# EAGLE schematic Counter (EAGLE 6.2)
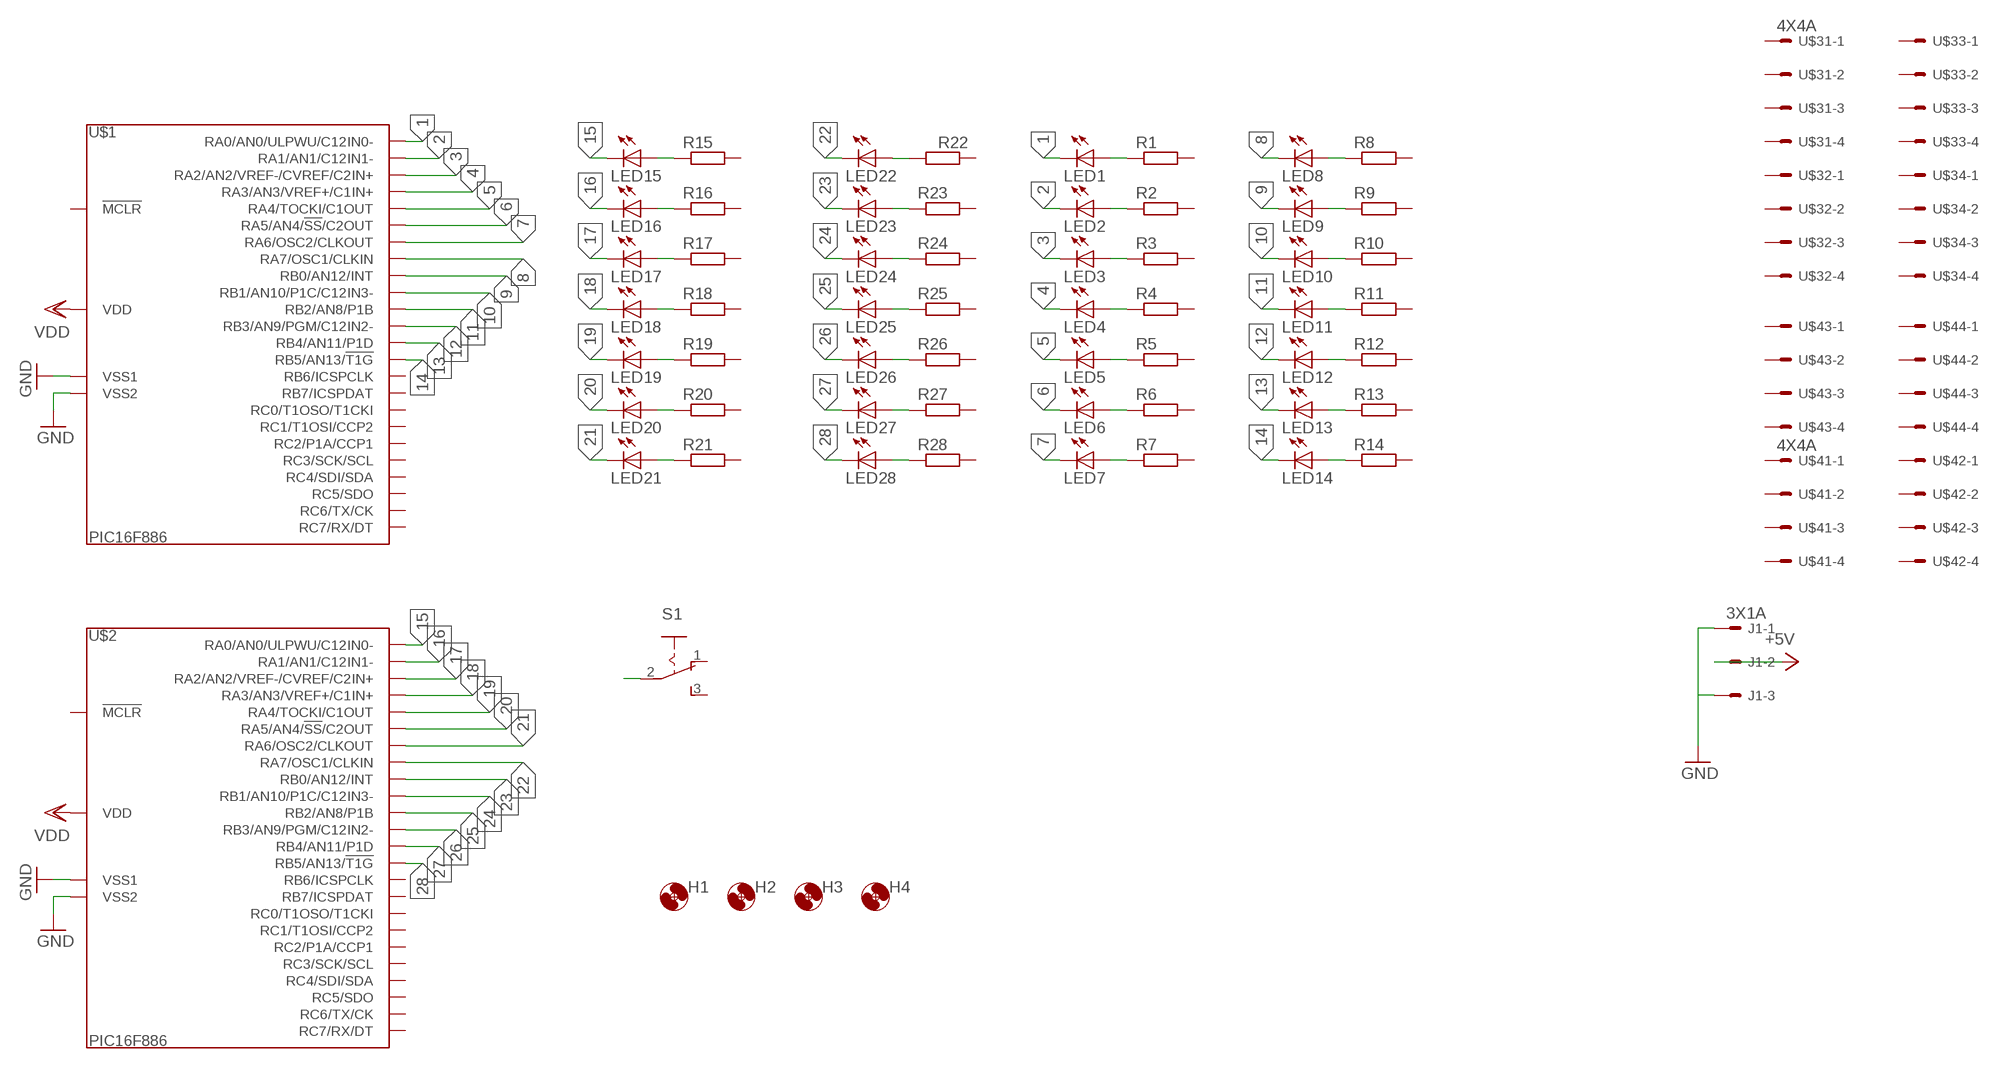
[diagram p0: schematic, sheet 1]

## Parts
H1  HOLE3.3M3BOLT  [HOLE3.3]
H2  HOLE3.3M3BOLT  [HOLE3.3]
H3  HOLE3.3M3BOLT  [HOLE3.3]
H4  HOLE3.3M3BOLT  [HOLE3.3]
J1  3X1A  [37203-62A3-003]
LED1  LED5MM  [LED5MM]
LED2  LED5MM  [LED5MM]
LED3  LED5MM  [LED5MM]
LED4  LED5MM  [LED5MM]
LED5  LED5MM  [LED5MM]
LED6  LED5MM  [LED5MM]
LED7  LED5MM  [LED5MM]
LED8  LED5MM  [LED5MM]
LED9  LED5MM  [LED5MM]
LED10  LED5MM  [LED5MM]
LED11  LED5MM  [LED5MM]
LED12  LED5MM  [LED5MM]
LED13  LED5MM  [LED5MM]
LED14  LED5MM  [LED5MM]
LED15  LED5MM  [LED5MM]
LED16  LED5MM  [LED5MM]
LED17  LED5MM  [LED5MM]
LED18  LED5MM  [LED5MM]
LED19  LED5MM  [LED5MM]
LED20  LED5MM  [LED5MM]
LED21  LED5MM  [LED5MM]
LED22  LED5MM  [LED5MM]
LED23  LED5MM  [LED5MM]
LED24  LED5MM  [LED5MM]
LED25  LED5MM  [LED5MM]
LED26  LED5MM  [LED5MM]
LED27  LED5MM  [LED5MM]
LED28  LED5MM  [LED5MM]
R1  R-EU_R3216W  [R3216W]
R2  R-EU_R3216W  [R3216W]
R3  R-EU_R3216W  [R3216W]
R4  R-EU_R3216W  [R3216W]
R5  R-EU_R3216W  [R3216W]
R6  R-EU_R3216W  [R3216W]
R7  R-EU_R3216W  [R3216W]
R8  R-EU_R3216W  [R3216W]
R9  R-EU_R3216W  [R3216W]
R10  R-EU_R3216W  [R3216W]
R11  R-EU_R3216W  [R3216W]
R12  R-EU_R3216W  [R3216W]
R13  R-EU_R3216W  [R3216W]
R14  R-EU_R3216W  [R3216W]
R15  R-EU_R3216W  [R3216W]
R16  R-EU_R3216W  [R3216W]
R17  R-EU_R3216W  [R3216W]
R18  R-EU_R3216W  [R3216W]
R19  R-EU_R3216W  [R3216W]
R20  R-EU_R3216W  [R3216W]
R21  R-EU_R3216W  [R3216W]
R22  R-EU_R3216W  [R3216W]
R23  R-EU_R3216W  [R3216W]
R24  R-EU_R3216W  [R3216W]
R25  R-EU_R3216W  [R3216W]
R26  R-EU_R3216W  [R3216W]
R27  R-EU_R3216W  [R3216W]
R28  R-EU_R3216W  [R3216W]
S1  SLIDESW  [SLIDESW]
U$1  PIC16F886  [DIL28]
U$2  PIC16F886  [DIL28]
U$3  4X4A  [37216-62A3-004]
U$4  4X4A  [37216-62A3-004]

## Nets
1: LED1.K(C) U$1.2(RA0/AN0/ULPWU/C12IN0-)
2: LED2.K(C) U$1.3(RA1/AN1/C12IN1-)
3: LED3.K(C) U$1.4(RA2/AN2/VREF-/CVREF/C2IN+)
4: LED4.K(C) U$1.5(RA3/AN3/VREF+/C1IN+)
5: LED5.K(C) U$1.6(RA4/TOCKI/C1OUT)
6: LED6.K(C) U$1.7(RA5/AN4/!SS!/C2OUT)
7: LED7.K(C) U$1.10(RA6/OSC2/CLKOUT)
8: LED8.K(C) U$1.9(RA7/OSC1/CLKIN)
9: LED9.K(C) U$1.21(RB0/AN12/INT)
10: LED10.K(C) U$1.22(RB1/AN10/P1C/C12IN3-)
11: LED11.K(C) U$1.23(RB2/AN8/P1B)
12: LED12.K(C) U$1.24(RB3/AN9/PGM/C12IN2-)
13: LED13.K(C) U$1.25(RB4/AN11/P1D)
14: LED14.K(C) U$1.26(RB5/AN13/!T1G)
15: LED15.K(C)
16: LED16.K(C)
17: LED17.K(C)
18: LED18.K(C)
19: LED19.K(C)
20: LED20.K(C)
21: LED21.K(C)
22: LED22.K(C)
23: LED23.K(C)
24: LED24.K(C)
25: LED25.K(C)
26: LED26.K(C)
27: LED27.K(C)
28: LED28.K(C)
+5V: J1.1-2
GND: J1.1-1 J1.1-3 U$1.8(VSS1) U$1.19(VSS2) U$2.8(VSS1) U$2.19(VSS2)
N$1: LED1.A R1.1
N$2: LED2.A R2.1
N$3: LED3.A R3.1
N$4: LED4.A R4.1
N$5: LED5.A R5.1
N$6: LED6.A R6.1
N$7: LED7.A R7.1
N$8: LED8.A R8.1
N$9: LED9.A R9.1
N$10: LED10.A R10.1
N$11: LED11.A R11.1
N$12: LED12.A R12.1
N$13: LED13.A R13.1
N$14: LED14.A R14.1
N$15: LED15.A R15.1
N$16: LED16.A R16.1
N$17: LED17.A R17.1
N$18: LED18.A R18.1
N$19: LED19.A R19.1
N$20: LED20.A R20.1
N$21: LED21.A R21.1
N$22: LED22.A R22.2
N$23: LED23.A R23.1
N$24: LED24.A R24.1
N$25: LED25.A R25.1
N$26: LED26.A R26.1
N$27: LED27.A R27.1
N$28: LED28.A R28.1
N$29: S1.2
VDD: U$1.20(VDD) U$2.20(VDD)
Unconnected: R1.2 R2.2 R3.2 R4.2 R5.2 R6.2 R7.2 R8.2 R9.2 R10.2 R11.2 R12.2 R13.2 R14.2 R15.2 R16.2 R17.2 R18.2 R19.2 R20.2 R21.2 R22.1 R23.2 R24.2 R25.2 R26.2 R27.2 R28.2 S1.1 S1.3 U$1.1(!MCLR) U$1.11(RC0/T1OSO/T1CKI) U$1.12(RC1/T1OSI/CCP2) U$1.13(RC2/P1A/CCP1) U$1.14(RC3/SCK/SCL) U$1.15(RC4/SDI/SDA) U$1.16(RC5/SDO) U$1.17(RC6/TX/CK) U$1.18(RC7/RX/DT) U$1.27(RB6/ICSPCLK) U$1.28(RB7/ICSPDAT) U$2.1(!MCLR) U$2.2(RA0/AN0/ULPWU/C12IN0-) U$2.3(RA1/AN1/C12IN1-) U$2.4(RA2/AN2/VREF-/CVREF/C2IN+) U$2.5(RA3/AN3/VREF+/C1IN+) U$2.6(RA4/TOCKI/C1OUT) U$2.7(RA5/AN4/!SS!/C2OUT) U$2.9(RA7/OSC1/CLKIN) U$2.10(RA6/OSC2/CLKOUT) U$2.11(RC0/T1OSO/T1CKI) U$2.12(RC1/T1OSI/CCP2) U$2.13(RC2/P1A/CCP1) U$2.14(RC3/SCK/SCL) U$2.15(RC4/SDI/SDA) U$2.16(RC5/SDO) U$2.17(RC6/TX/CK) U$2.18(RC7/RX/DT) U$2.21(RB0/AN12/INT) U$2.22(RB1/AN10/P1C/C12IN3-) U$2.23(RB2/AN8/P1B) U$2.24(RB3/AN9/PGM/C12IN2-) U$2.25(RB4/AN11/P1D) U$2.26(RB5/AN13/!T1G) U$2.27(RB6/ICSPCLK) U$2.28(RB7/ICSPDAT) U$3.1-1 U$3.1-2 U$3.1-3 U$3.1-4 U$3.2-1 U$3.2-2 U$3.2-3 U$3.2-4 U$3.3-1 U$3.3-2 U$3.3-3 U$3.3-4 U$3.4-1 U$3.4-2 U$3.4-3 U$3.4-4 U$4.1-1 U$4.1-2 U$4.1-3 U$4.1-4 U$4.2-1 U$4.2-2 U$4.2-3 U$4.2-4 U$4.3-1 U$4.3-2 U$4.3-3 U$4.3-4 U$4.4-1 U$4.4-2 U$4.4-3 U$4.4-4

## Library data of the parts
H1-H4 = Hole:HOLE3.3
J1 = 3M_372xx:3X1
LED1-LED28 = FP-21T for MITS:LED: LED OSRAM: - CHIPLED LG R971, LG N971, LY N971, LG Q971, LY Q971, LO R971, LY R971 LH N974, LH R974 LS Q976, LO Q976, LY Q976 LO Q996 - Hyper CHIPLED LW Q18S LB Q993, LB Q99A, LB R99A - SideLED LS A670, LO A670, LY A670, LG A670, LP A670 LB A673, LV A673, LT A673, LW A673 LH A674 LY A675 LS A676, LA A676, LO A676, LY A676, LW A676 LS A679, LY A679, LG A679 - Hyper Micro SIDELED® LS Y876, LA Y876, LO Y876, LY Y876 LT Y87S - SmartLED LW L88C, LW L88S LB L89C, LB L89S, LG L890 LS L89K, LO L89K, LY L89K LS L896, LA L896, LO L896, LY L896 - TOPLED LS T670, LO T670, LY T670, LG T670, LP T670 LSG T670, LSP T670, LSY T670, LOP T670, LYG T670 LG T671, LOG T671, LSG T671 LB T673, LV T673, LT T673, LW T673 LH T674 LS T676, LA T676, LO T676, LY T676, LB T676, LH T676, LSB T676, LW T676 LB T67C, LV T67C, LT T67C, LS T67K, LO T67K, LY T67K, LW E67C LS E67B, LA E67B, LO E67B, LY E67B, LB E67C, LV E67C, LT E67C LW T67C LS T679, LY T679, LG T679 LS T770, LO T770, LY T770, LG T770, LP T770 LB T773, LV T773, LT T773, LW T773 LH T774 LS E675, LA E675, LY E675, LS T675 LS T776, LA T776, LO T776, LY T776, LB T776 LHGB T686 LT T68C, LB T68C - Hyper Mini TOPLED® LB M676 - Mini TOPLED Santana® LG M470 LS M47K, LO M47K, LY M47K Source: http://www.osram.convergy.de - LUMILED® LXK2-PW12-R00, LXK2-PW12-S00, LXK2-PW14-U00, LXK2-PW14-V00 LXK2-PM12-R00, LXK2-PM12-S00, LXK2-PM14-U00 LXK2-PE12-Q00, LXK2-PE12-R00, LXK2-PE12-S00, LXK2-PE14-T00, LXK2-PE14-U00 LXK2-PB12-K00, LXK2-PB12-L00, LXK2-PB12-M00, LXK2-PB14-N00, LXK2-PB14-P00, LXK2-PB14-Q00 LXK2-PR12-L00, LXK2-PR12-M00, LXK2-PR14-Q00, LXK2-PR14-R00 LXK2-PD12-Q00, LXK2-PD12-R00, LXK2-PD12-S00 LXK2-PH12-R00, LXK2-PH12-S00 LXK2-PL12-P00, LXK2-PL12-Q00, LXK2-PL12-R00 Source: www.luxeon.com
R1-R28 = rcl:R-EU_: RESISTOR, European symbol
S1 = switch:SLIDESW
U$1 U$2 = PIC:PIC16F886
U$3 U$4 = 3M_372xx:4X4